# Altium schematic sheet CLOCK.SchDoc
size A3; Organization: ICNS, MARCS Institute; Address1: Werrington South Campus, Great Western Highway; Address2: Werrington, NSW, 2747; SheetNumber: 7; SheetTotal: 16
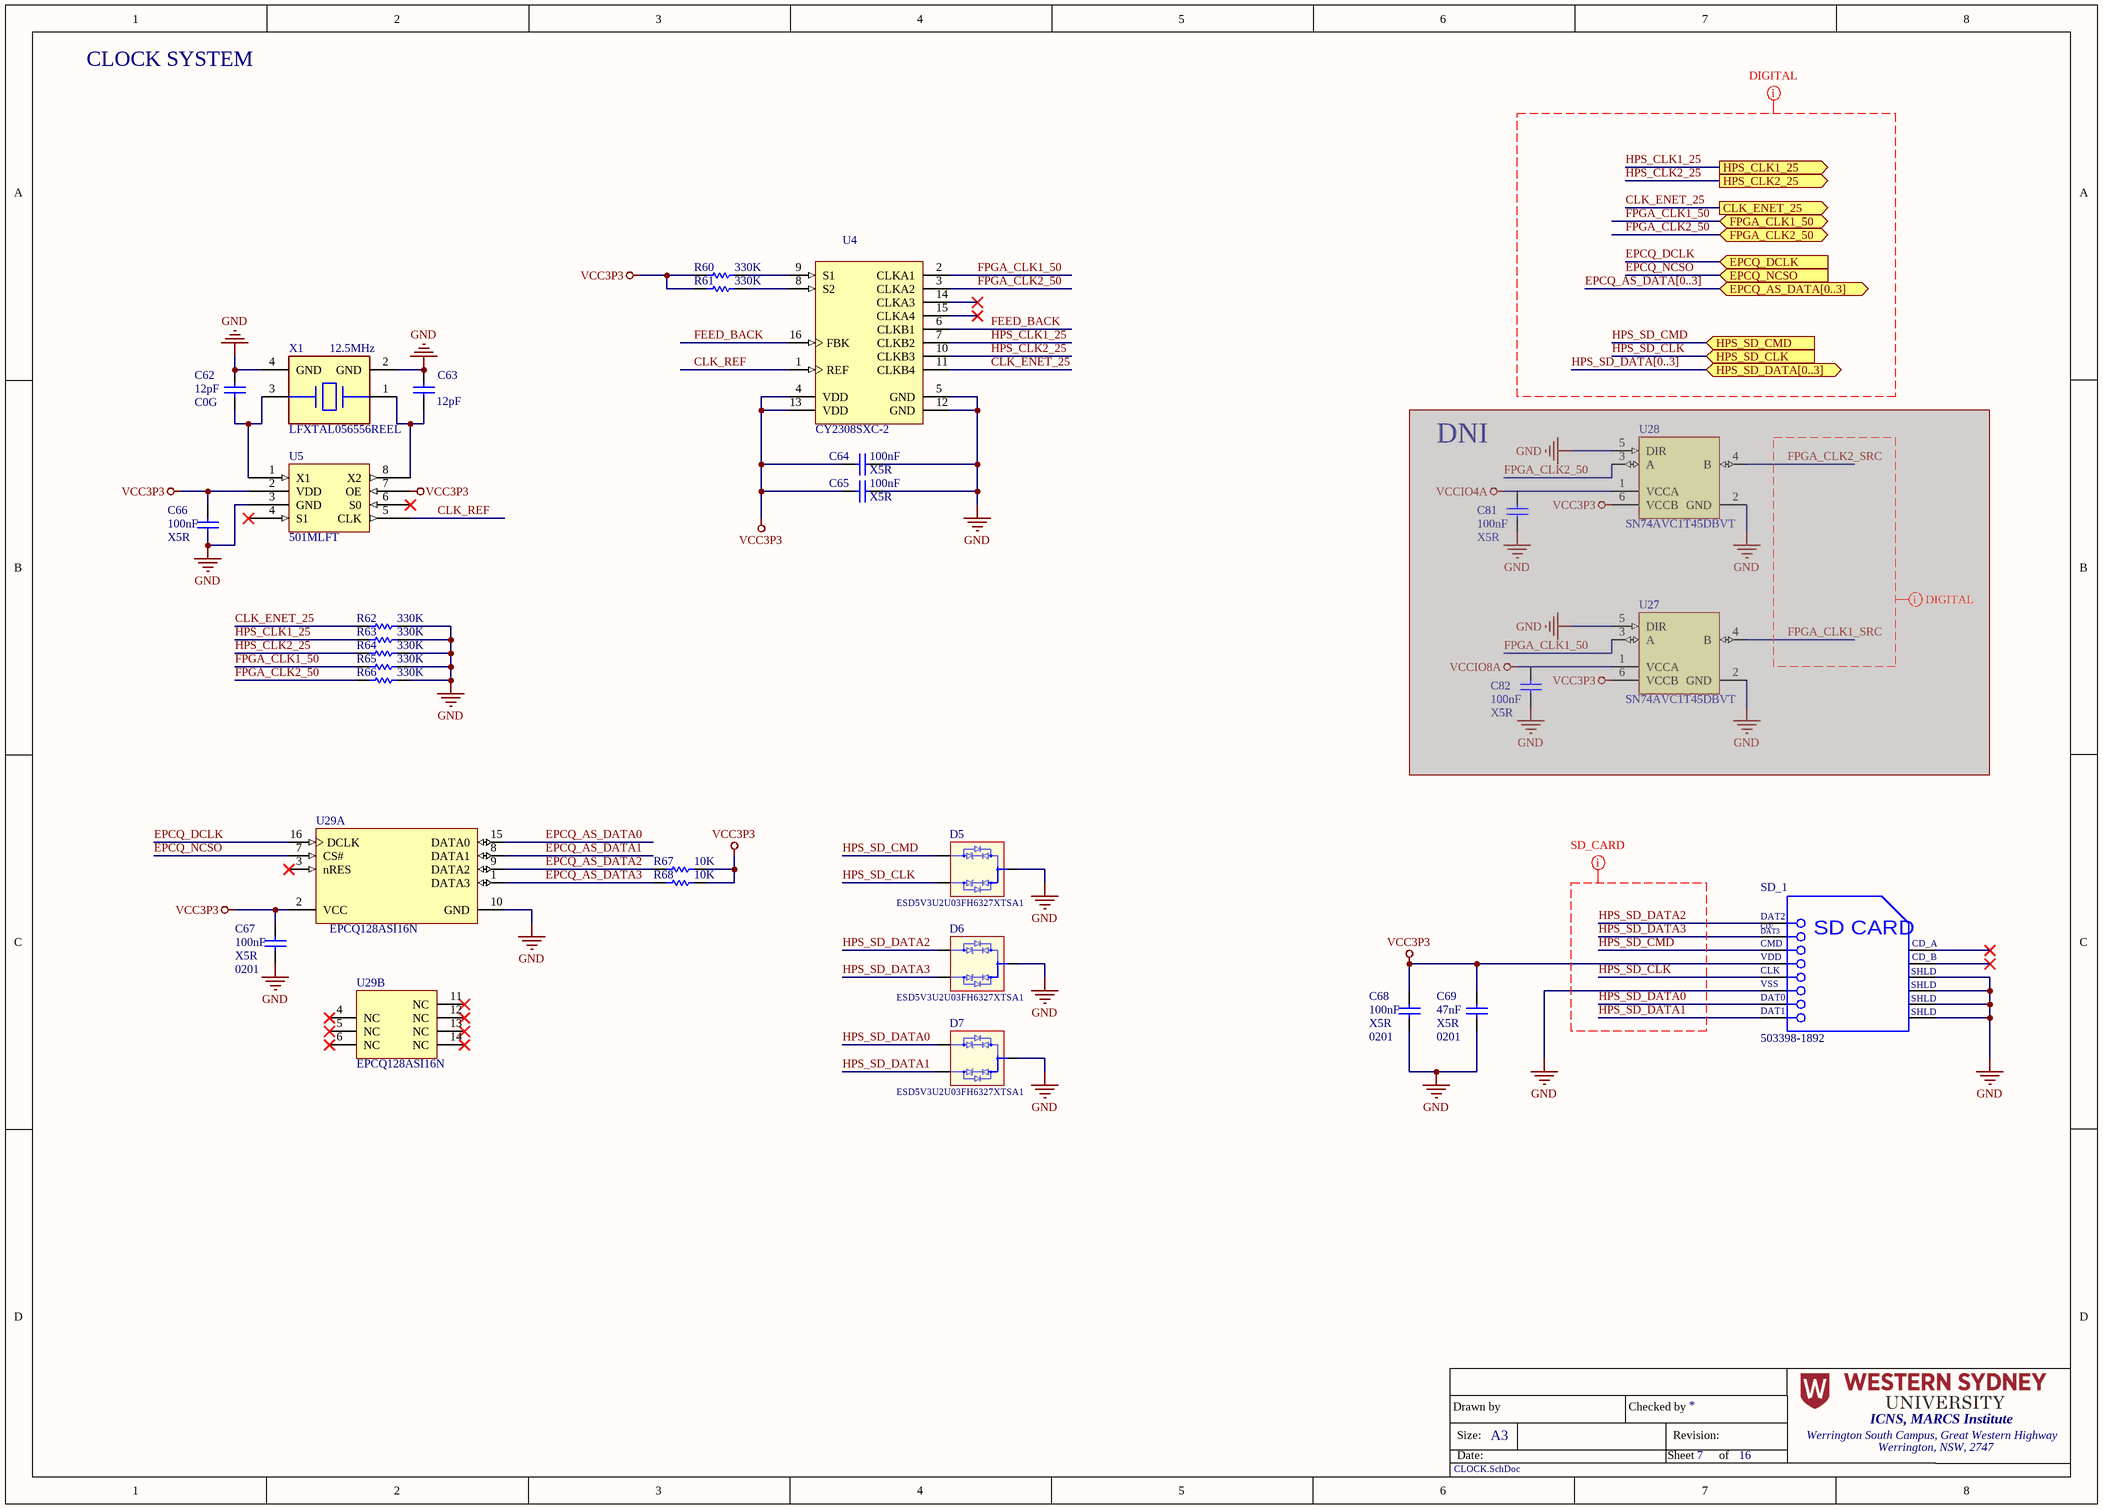
[diagram p0: CLOCK.SchDoc]

## Parts
C62  value 12pF  Dielectric: C0G  [CAP 0201 (0603)]  (hidden comment: GRM0335C1H120GA01D)
C63  value 12pF  [CAP 0201 (0603)]  (hidden comment: GRM0335C1H120GA01D)
C64  Dielectric: X5R  Capacitance: 100nF  [CAP 0201 (0603)]  (hidden comment: CL03A104KP3NNNC)
C65  Dielectric: X5R  Capacitance: 100nF  [CAP 0201 (0603)]  (hidden comment: CL03A104KP3NNNC)
C66  Capacitance: 100nF  Dielectric: X5R  [CAP 0201 (0603)]  (hidden comment: CL03A104KP3NNNC)
C67  Capacitance: 100nF  Case Code (Imperial): 0201  Dielectric: X5R  [CAP 0201 (0603)]  (hidden comment: CL03A104KP3NNNC)
C68  Capacitance: 100nF  Case Code (Imperial): 0201  Dielectric: X5R  [CAP 0201 (0603)]  (hidden comment: CL03A104KP3NNNC)
C69  value 47nF  Dielectric: X5R  Case Code (Imperial): 0201  [CAP 0201 (0603)]  (hidden comment: GRM033R60J473KE19D)
C81  Capacitance: 100nF  Dielectric: X5R  [CAP 0201 (0603)]  (hidden comment: CL03A104KP3NNNC)  (masked out: inside a compile mask, not in the netlist)
C82  Capacitance: 100nF  Dielectric: X5R  [CAP 0201 (0603)]  (hidden comment: CL03A104KP3NNNC)  (masked out: inside a compile mask, not in the netlist)
D5  ESD5V3U2U03FH6327XTSA1  [TSFP-3-1_INF]
D6  ESD5V3U2U03FH6327XTSA1  [TSFP-3-1_INF]
D7  ESD5V3U2U03FH6327XTSA1  [TSFP-3-1_INF]
R60  value 330K  [RES 0201 (0603)]  (hidden comment: ERJ-1GNF3303C)
R61  value 330K  [RES 0201 (0603)]  (hidden comment: ERJ-1GNF3303C)
R62  value 330K  [RES 0201 (0603)]  (hidden comment: ERJ-1GNF3303C)
R63  value 330K  [RES 0201 (0603)]  (hidden comment: ERJ-1GNF3303C)
R64  value 330K  [RES 0201 (0603)]  (hidden comment: ERJ-1GNF3303C)
R65  value 330K  [RES 0201 (0603)]  (hidden comment: ERJ-1GNF3303C)
R66  value 330K  [RES 0201 (0603)]  (hidden comment: ERJ-1GNF3303C)
R67  value 10K  [RES 0201 (0603)]  (hidden comment: AC0201FR-0710KL)
R68  value 10K  [RES 0201 (0603)]  (hidden comment: AC0201FR-0710KL)
SD_1  503398-1892  [MOLX-503398-1892_V]
U4  CY2308SXC-2  [CYP-SX16_N]
U5  501MLFT  [SOIC127P600X135-8N]
U27  SN74AVC1T45DBVT  [DBV0006A_L]  (masked out: inside a compile mask, not in the netlist)
U28  SN74AVC1T45DBVT  [DBV0006A_L]  (masked out: inside a compile mask, not in the netlist)
U29  EPCQ128ASI16N  [SPSN-SOIC-16_L]  (parts A,B of 2)
X1  LFXTAL056556REEL  Frequency: 12.5MHz  [TXC-7B-4_V]

## Ports
CLK_ENET_25 (out), EPCQ_AS_DATA[0..3] (bidir), EPCQ_DCLK (in), EPCQ_NCSO (in), FPGA_CLK1_50 (bidir), FPGA_CLK2_50 (bidir), HPS_CLK1_25 (out), HPS_CLK2_25 (out), HPS_SD_CLK (in), HPS_SD_CMD (in), HPS_SD_DATA[0..3] (bidir)

## Nets
GND: C62.2 C63.1 C64.2 C65.2 C66.2 C67.2 C68.2 C69.2 D5.3(A) D6.3(A) D7.3(A) R62.2 R63.2 R64.2 R65.2 R66.2 SD_1.6(VSS) SD_1.11(SHLD) SD_1.12(SHLD) SD_1.13(SHLD) SD_1.14(SHLD) U4.5(GND) U4.12(GND) U5.3(GND) U29.10(GND) X1.2(GND) X1.4(GND)
VCC3P3: C64.1 C65.1 C66.1 C67.1 C68.1 C69.1 R60.1 R61.1 R67.2 R68.2 SD_1.4(VDD) U4.4(VDD) U4.13(VDD) U5.2(VDD) U5.7(OE) U29.2(VCC)
CLK_ENET_25: R62.1 U4.11(CLKB4) ; port CLK_ENET_25
CLK_REF: U4.1(REF) U5.5(CLK)
EPCQ_AS_DATA0: U29.15(DATA0)
EPCQ_AS_DATA1: U29.8(DATA1)
EPCQ_AS_DATA2: R67.1 U29.9(DATA2)
EPCQ_AS_DATA3: R68.1 U29.1(DATA3)
EPCQ_DCLK: U29.16(DCLK) ; port EPCQ_DCLK
EPCQ_NCSO: U29.7(CS#) ; port EPCQ_NCSO
FEED_BACK: U4.6(CLKB1) U4.16(FBK)
FPGA_CLK1_50: R65.1 U4.2(CLKA1) ; port FPGA_CLK1_50
FPGA_CLK2_50: R66.1 U4.3(CLKA2) ; port FPGA_CLK2_50
HPS_CLK1_25: R63.1 U4.7(CLKB2) ; port HPS_CLK1_25
HPS_CLK2_25: R64.1 U4.10(CLKB3) ; port HPS_CLK2_25
HPS_SD_CLK: D5.2(K2) SD_1.5(CLK) ; port HPS_SD_CLK
HPS_SD_CMD: D5.1(K1) SD_1.3(CMD) ; port HPS_SD_CMD
HPS_SD_DATA0: D7.1(K1) SD_1.7(DAT0)
HPS_SD_DATA1: D7.2(K2) SD_1.8(DAT1)
HPS_SD_DATA2: D6.1(K1) SD_1.1(DAT2)
HPS_SD_DATA3: D6.2(K2) SD_1.2(CD/DAT3)
NetC62_1: C62.1 U5.1(X1) X1.3
NetC63_2: C63.2 U5.8(X2) X1.1
NetR60_2: R60.2 U4.9(S1)
NetR61_2: R61.2 U4.8(S2)

Not connected (* = marked no-connect by the designer): SD_1 9(CD_A)* 10(CD_B)*; U4 14(CLKA3)* 15(CLKA4)*; U5 4(S1)* 6(S0)*; U29 3(nRES)* 4(NC)* 5(NC)* 6(NC)* 11(NC)* 12(NC)* 13(NC)* 14(NC)*

## Buses and harness runs
bus EPCQ_AS_DATA[0..3] = port EPCQ_AS_DATA[0..3]
bus HPS_SD_DATA[0..3] = port HPS_SD_DATA[0..3]

## Layout directives
net class DIGITAL: CLK_ENET_25, EPCQ_AS_DATA[0..3], EPCQ_DCLK, EPCQ_NCSO, FPGA_CLK1_50, FPGA_CLK1_SRC, FPGA_CLK2_50, FPGA_CLK2_SRC, HPS_CLK1_25, HPS_CLK2_25, HPS_SD_CLK, HPS_SD_CMD, HPS_SD_DATA[0..3]
net class SD_CARD: HPS_SD_CLK, HPS_SD_CMD, HPS_SD_DATA0, HPS_SD_DATA1, HPS_SD_DATA2, HPS_SD_DATA3

## Notes on the sheet
- CLOCK SYSTEM
- DNI
- Drawn by
- Size:
- Date:
- A3
- Checked by
- Sheet
- Revision:
- of
- (in symbol CMP-002-00074-2) CD/; DAT3; SD CARD

## Library data of the parts
C62 = CMP-003-000026-2: Cap Multilayer Ceramic 12 pF 50 V C0G/NP0 0201 10%; Manufacturer: Murata; Voltage Rating: 50V; Tolerance: 2%; Termination: SMD/SMT; Mount: Surface Mount; Depth: 0.3mm; Case Code (Metric): 0603; Height: 0.3mm; Voltage Rating (DC): 50V; Case Code (Imperial): 0201; Package Quantity: 15000; Thickness: 0.013inch; Length: 0.6mm; Min Operating Temperature: -55°C; Width: 0.012inch; Capacitance: 12pF; Case/Package: 0201; Packaging: Tape and Reel; Series: GRM; Max Operating Temperature: 125°C; Stock 1: 30000; RoHS: Yes; ComponentLink1Description: https://datasheet.ciiva.com/29538/partnumbering-e-01-29538559.pdf?src-supplier=Digi-Key; Pricing 1: 1=0.00400, 15000=0.00400 (USD); Source: ICNS_PropheseeLib.SchLib; Manufacturer Part Number: GRM0335C1H120GA01D; Category: Ceramic Capacitors; Design Item ID: GRM0335C1H120GA01D; ComponentLink1URL: https://datasheet.ciiva.com/29538/partnumbering-e-01-29538559.pdf?src-supplier=Digi-Key
C63 = CMP-003-000026-2: Cap Multilayer Ceramic 12 pF 50 V C0G/NP0 0201 10%; Manufacturer: Murata; Voltage Rating: 50V; Tolerance: 2%; Dielectric: C0G; Termination: SMD/SMT; Mount: Surface Mount; Depth: 0.3mm; Case Code (Metric): 0603; Height: 0.3mm; Voltage Rating (DC): 50V; Case Code (Imperial): 0201; Package Quantity: 15000; Thickness: 0.013inch; Length: 0.6mm; Min Operating Temperature: -55°C; Width: 0.012inch; Capacitance: 12pF; Case/Package: 0201; Packaging: Tape and Reel; Series: GRM; Max Operating Temperature: 125°C; Stock 1: 30000; RoHS: Yes; ComponentLink1Description: https://datasheet.ciiva.com/29538/partnumbering-e-01-29538559.pdf?src-supplier=Digi-Key; Pricing 1: 1=0.00400, 15000=0.00400 (USD); Source: ICNS_PropheseeLib.SchLib; Manufacturer Part Number: GRM0335C1H120GA01D; Category: Ceramic Capacitors; Design Item ID: GRM0335C1H120GA01D; ComponentLink1URL: https://datasheet.ciiva.com/29538/partnumbering-e-01-29538559.pdf?src-supplier=Digi-Key
C64-C68 C81 C82 = CMP-003-000014-1: Cap Ceramic 0.1uF 10V X5R 10% Pad SMD 0201 85C T/R; Manufacturer: Samsung; Voltage Rating: 10V; Value: 0.1uF; Tolerance: 10%; RoHS: Yes; Source: ICNS_PropheseeLib.SchLib; Depth: 0.3mm; Mount: Surface Mount; Stock 1: 12175; Package Quantity: 1; Packaging: Tape and Reel; ComponentLink1Description: https://datasheet.ciiva.com/25803/cl03a104kp3nnnc-25803204.pdf?src-supplier=Digi-Key; Case Code (Metric): 0603; Manufacturer Part Number: CL03A104KP3NNNC; Lead Free: Lead Free; Width: 0.012inch; Length: 0.6mm; Radiation Hardening: No; Height: 0.3mm; Series: CL; Thickness: 0.013inch; ComponentLink2Description: https://datasheet.ciiva.com/26838/getdatasheetpartid-357484-26838083.pdf?src-supplier=Verical; Max Operating Temperature: 85°C; ComponentLink2URL: https://datasheet.ciiva.com/26838/getdatasheetpartid-357484-26838083.pdf?src-supplier=Verical; Design Item ID: CL03A104KP3NNNC; Voltage Rating (DC): 10V; Case/Package: 0201; Contact Plating: Tin; Category: Ceramic Capacitors; Min Operating Temperature: -55°C; Construction: Flat; Pricing 1: 1=0.10000, 10=0.02900, 50=0.01600, 100=0.01300, 500=0.00932, 1000=0.00732, 2500=0.00666, 5000=0.00612 (USD); ComponentLink1URL: https://datasheet.ciiva.com/25803/cl03a104kp3nnnc-25803204.pdf?src-supplier=Digi-Key
  C64-C66 C81 C82: Case Code (Imperial): 0201
C69 = CMP-003-000019-1: Cap Multilayer Ceramic 47nF 6.3V X5R SMT 0201±10% Tolerance; Manufacturer: Murata; Tolerance: 10%; Depth: 0.3mm; Capacitance: 47nF; Case/Package: 0201; REACH SVHC: No SVHC; Termination: SMD/SMT; Mount: Surface Mount; Radiation Hardening: No; Height: 0.3mm; Min Operating Temperature: -55°C; Max Operating Temperature: 85°C; Thickness: 0.013inch; Length: 0.6mm; Voltage Rating (DC): 6.3V; Material: Ceramic; Lead Free: Lead Free; Packaging: Tape and Reel; Case Code (Metric): 0603; Width: 0.012inch; Voltage Rating: 6.3V; Package Quantity: 15000; ComponentLink3URL: https://datasheet.ciiva.com/29199/455678-da-01-en-vs-kondensator-0201-29199271.pdf?src-supplier=Conrad; Stock 1: 134562; ComponentLink1Description: https://datasheet.ciiva.com/6270/product-6270930.pdf?src-supplier=Digi-Key; RoHS Compliant: Yes; ComponentLink2Description: https://datasheet.ciiva.com/18184/getdatasheetpartid-223883-18184048.pdf?src-supplier=Verical; ComponentLink3Description: https://datasheet.ciiva.com/29199/455678-da-01-en-vs-kondensator-0201-29199271.pdf?src-supplier=Conrad; Category: Ceramic Capacitors; ComponentLink2URL: https://datasheet.ciiva.com/18184/getdatasheetpartid-223883-18184048.pdf?src-supplier=Verical; Series: GRM; ComponentLink1URL: https://datasheet.ciiva.com/6270/product-6270930.pdf?src-supplier=Digi-Key; RoHS: Yes; Source: ICNS_PropheseeLib.SchLib; Manufacturer Part Number: GRM033R60J473KE19D; Construction: Flat; Pricing 1: 1=0.10000, 10=0.05900, 50=0.03240, 100=0.02640, 500=0.01886, 1000=0.01482, 2500=0.01348, 5000=0.01240 (USD); Design Item ID: GRM033R60J473KE19D
D5-D7 = CMP-004-000005-1: ESD5V3U2U Series 2 Line 5.3 V 0.4 pF 15 Vcl Uni-Directional TVS Diode -TSFP-3-1; Manufacturer: Infineon; Min Breakdown Voltage: 6V; Number of Unidirectional Channels: 2; Peak Pulse Current: 3A; Leakage Current: 50nA; Working Voltage: 5.3V; Diode Type: ZENER; Direction: Unidirectional; Clamping Voltage: 15V; Element Configuration: Dual; Power Line Protection: No; Capacitance: 0.6pF; ComponentLink1URL: https://datasheet.ciiva.com/11195/infineon-esd5v3u2useries-ds-v01-03-en-11195325.pdf?src-supplier=Avnet; ComponentLink1Description: https://datasheet.ciiva.com/11195/infineon-esd5v3u2useries-ds-v01-03-en-11195325.pdf?src-supplier=Avnet; Manufacturer Part Number: ESD5V3U2U03FH6327XTSA1; Series: -; Packaging: Tape and Reel; Case/Package: SOT-723; Lead Free: Lead Free; Depth: 0.8mm; RoHS: Yes; Max Operating Temperature: 125°C; Stock 1: 2789; Mount: Surface Mount; Resistor Type: Zener; Category: Diodes; Source: ICNS_PropheseeLib.SchLib; Pricing 1: 1=0.41000, 10=0.33100, 100=0.22520, 500=0.16892, 1000=0.12668 (USD); Contact Plating: Tin,Matte; Halogen Free: Halogen Free; Design Item ID: ESD5V3U2U03FH6327XTSA1; Length: 1.2mm; Number of Pins: 3; Radiation Hardening: No; Reverse Standoff Voltage: 5.3V; Min Operating Temperature: -40°C
R60-R66 = CMP-006-000055-1: Res Thick Film 0201 330K Ohm 1% 0.05W(1/20W) ±200ppm/C Pad SMD Automotive T/R; Manufacturer: Panasonic; Voltage Rating (DC): 25V; Resistance: 330kR; Max Power Dissipation: 50mW; Temperature Coefficient: 200ppm/°C; Case Code (Imperial): 0201; Length: 0.024inch; Source: ICNS_PropheseeLib.SchLib; Radiation Hardening: No; REACH SVHC: No SVHC; ComponentLink4URL: https://datasheet.ciiva.com/24069/aoa0000ce2-24069610.pdf?src-supplier=Mouser; Manufacturer Part Number: ERJ-1GNF3303C; Number of Terminations: 2; RoHS Compliant: Yes; Package Quantity: 15000; Packaging: Tape and Reel; Tolerance: 1%; Case/Package: 0201; RoHS: Yes; Resistor Type: Thick Film; Category: Chip SMD Resistors; Design Item ID: ERJ-1GNF3303C; Height: 0.01inch; Voltage Rating: 25V; Number of Pins: 2; ComponentLink3URL: https://datasheet.ciiva.com/46375/1678782-46375419.pdf?src-supplier=Element14; ComponentLink3Description: https://datasheet.ciiva.com/46375/1678782-46375419.pdf?src-supplier=Element14; Power Rating: 50mW; ComponentLink1Description: https://datasheet.ciiva.com/7836/1678782-7836473.pdf?src-supplier=Element14; Stock 1: 15000; ComponentLink4Description: https://datasheet.ciiva.com/24069/aoa0000ce2-24069610.pdf?src-supplier=Mouser; Mount: Surface Mount; Series: ERJ; ComponentLink2URL: https://datasheet.ciiva.com/43467/1678782-43467114.pdf?src-supplier=Farnell; Width: 0.3mm; ComponentLink2Description: https://datasheet.ciiva.com/43467/1678782-43467114.pdf?src-supplier=Farnell; Pricing 1: 15000=0.00900 (USD); Resistance Tolerance: 1%; ComponentLink1URL: https://datasheet.ciiva.com/7836/1678782-7836473.pdf?src-supplier=Element14; Case Code (Metric): 0603; Min Operating Temperature: -55°C; Termination: SMD/SMT; Max Operating Temperature: 125°C
R67 R68 = CMP-006-000021-1: Res Thick Film 0201 10K Ohm 1% 0.05W(1/20W) ±200ppm/C Pad SMD Automotive T/R; Manufacturer: Yageo; Max Power Dissipation: 50mW; Resistance: 10kR; Temperature Coefficient: 200ppm/°C; Length: 0.024inch; Packaging: Tape and Reel; ComponentLink1URL: http://www.yageo.com/NewPortal/yageodocoutput?fileName=/pdf/R-Chip/PYu-AC_51_RoHS_L_6.pdf&src-supplier=Digi-Key; Number of Terminations: 2; Case/Package: 0201; Source: ICNS_PropheseeLib.SchLib; Case Code (Metric): 0603; Manufacturer Part Number: AC0201FR-0710KL; ComponentLink1Description: http://www.yageo.com/NewPortal/yageodocoutput?fileName=/pdf/R-Chip/PYu-AC_51_RoHS_L_6.pdf&src-supplier=Digi-Key; Min Operating Temperature: -55°C; Category: Chip SMD Resistors; Width: 0.012inch; RoHS: Yes; Max Operating Temperature: 155°C; Features: Moisture Resistant,Automotive AEC-Q200; Pricing 1: 1=0.10000, 10=0.06600, 100=0.02670, 1000=0.01201, 2500=0.01042, 5000=0.00861 (USD); Case Code (Imperial): 0201; Resistor Type: Thick Film; Stock 1: 698280; Design Item ID: AC0201FR-0710KL; Height: 0.01inch; Tolerance: 1%
SD_1 = CMP-002-00074-2: 1.10mm Pitch microSD Memory Card Connector, Normal Mount Surface Mount, Push-Push Type, 1.28mm Height; Current Rating: 500mA; Number of Circuits: 8; Voltage Rating (AC): 10V; Gender: Male; Pitch: 1.1mm; Packaging: Tape and Reel; Package Quantity: 2400; Mount: Surface Mount; Connector Type: Connector; Orientation: Right Angle; Number of Rows: 1; Number of Contacts: 8; Contact Material: Bronze,Stainless Steel; Length: 13.6mm; Halogen Free: Low Halogen; RoHS Compliant: Yes; Depth: 14.05mm; Max Operating Temperature: 85°C; REACH SVHC: Unknown; Radiation Hardening: No; Termination: Solder; Housing Material: Thermoplastic; Contact Plating: Gold; Width: 14.05mm; Min Operating Temperature: -25°C
U4 = CMP-008-000014-1: CY2308 Series Single PLL 3.3 V 133 MHz Zero Delay Clock Buffer SMT - SOIC-16; Manufacturer: Cypress; Number of Circuits: 1; Max Frequency: 133.3MHz; Input: LVTTL; PLL: Yes; Supply Voltage-Nom: 3.3V; Max Supply Voltage: 3.6V; Supply Current: 45mA; Min Supply Voltage: 3V; Number of Outputs: 8; RoHS: Yes; ComponentLink1Description: https://datasheet.ciiva.com/3998/docid49864-3998176.pdf?src-supplier=Arrow+Electronics; ComponentLink1URL: https://datasheet.ciiva.com/3998/docid49864-3998176.pdf?src-supplier=Arrow+Electronics; ComponentLink2Description: https://datasheet.ciiva.com/7648/59839-7648840.pdf?src-supplier=Element14; ComponentLink2URL: https://datasheet.ciiva.com/7648/59839-7648840.pdf?src-supplier=Element14; Manufacturer Part Number: CY2308SXC-2; Category: Clock Generators, PLLs, Frequency Synthesizers; Case/Package: SOIC; Min Operating Temperature: 0°C; Max Operating Temperature: 70°C; Package Quantity: 48; Packaging: Rail/Tube; Series: CY2308SXC; Design Item ID: CY2308SXC-2; Source: ICNS_PropheseeLib.SchLib; Number of Elements: 1; Contact Plating: Tin,Gold,Matte; Lead Free: Lead Free; ComponentLink5URL: https://datasheet.ciiva.com/1491/1509765-1491096.pdf?src-supplier=Element14; ComponentLink5Description: https://datasheet.ciiva.com/1491/1509765-1491096.pdf?src-supplier=Element14; Stock 1: 110; Number of Pins: 16; Frequency: 133.3MHz; RoHS Compliant: Yes; ComponentLink4URL: https://datasheet.ciiva.com/6676/cy2308-6676491.pdf?src-supplier=Digi-Key; ComponentLink3URL: https://datasheet.ciiva.com/30514/1921215-30514044.pdf?src-supplier=Jameco; Pricing 1: 1=10.85700, 10=9.41800, 25=9.24200, 100=7.68600, 250=7.12500, 500=7.05400, 1000=6.59300 (USD); Nominal Supply Current: 45mA; Operating Supply Voltage: 3.3V; ComponentLink4Description: https://datasheet.ciiva.com/6676/cy2308-6676491.pdf?src-supplier=Digi-Key; ComponentLink3Description: https://datasheet.ciiva.com/30514/1921215-30514044.pdf?src-supplier=Jameco; REACH SVHC: Unknown; Radiation Hardening: No
U5 = CMP-023-00000-3: PLL Clock Multiplier Single 8-Pin SOIC N T/R
U27 U28 = CMP-008-000009-1: Voltage Level Translator 1-CH Bidirectional 6-Pin SOT-23 T/R; Manufacturer: Texas Instruments; Output Type: 3-STATE; Number of Inputs: 1; Turn-On Delay Time: 5.6ns; Data Rate: 500Mbps; Low Level Output Current: 12mA; High Level Output Current: -12mA; Polarity: Non-Inverting; Max Supply Voltage: 3.6V; Propagation Delay: 2.8ns; Supply Current: 20uA; Min Supply Voltage: 1.2V; Number of Outputs: 2; Logic Function: Translator,Transceiver,Inverting; Weight: 0.000229oz; Series: 74AVC; Number of Channels: 1; Direction: Bidirectional; ComponentLink1Description: https://datasheet.ciiva.com/15086/getdatasheetpartid-49148-15086029.pdf?src-supplier=Verical; Min Operating Temperature: -40°C; Number of Bits: 1; ComponentLink2Description: https://datasheet.ciiva.com/7743/1534571-7743943.pdf?src-supplier=Element14; ComponentLink6URL: https://datasheet.ciiva.com/1508/1862374-1508650.pdf?src-supplier=Element14; Number of Pins: 6; Manufacturer Part Number: SN74AVC1T45DBVT; ComponentLink4Description: https://datasheet.ciiva.com/6614/sn74avc1t45-6614761.pdf?src-supplier=Digi-Key; Package Quantity: 250; RoHS Compliant: Yes; Height: 1.15mm; Category: Logic ICs; Width: 1.6mm; Stock 1: 5705; ComponentLink3URL: https://datasheet.ciiva.com/6614/sn74avc1t45-6614758.pdf?src-supplier=Digi-Key; RoHS: Yes; ComponentLink4URL: https://datasheet.ciiva.com/6614/sn74avc1t45-6614761.pdf?src-supplier=Digi-Key; ComponentLink6Description: https://datasheet.ciiva.com/1508/1862374-1508650.pdf?src-supplier=Element14; Technology: CMOS; ComponentLink7Description: https://datasheet.ciiva.com/1508/1862374-1508651.pdf?src-supplier=Element14; ComponentLink7URL: https://datasheet.ciiva.com/1508/1862374-1508651.pdf?src-supplier=Element14; Packaging: Tape and Reel; ComponentLink5URL: https://datasheet.ciiva.com/14287/sn74avc1t45-14287992.pdf?src-supplier=Avnet; ComponentLink1URL: https://datasheet.ciiva.com/15086/getdatasheetpartid-49148-15086029.pdf?src-supplier=Verical; ComponentLink3Description: https://datasheet.ciiva.com/6614/sn74avc1t45-6614758.pdf?src-supplier=Digi-Key; Number of Elements: 1; Case/Package: SOT-23; Design Item ID: SN74AVC1T45DBVT; ComponentLink5Description: https://datasheet.ciiva.com/14287/sn74avc1t45-14287992.pdf?src-supplier=Avnet; Radiation Hardening: No; Max Operating Temperature: 85°C; Lead Free: Lead Free; Nominal Supply Current: 20uA; REACH SVHC: No SVHC; ComponentLink2URL: https://datasheet.ciiva.com/7743/1534571-7743943.pdf?src-supplier=Element14; Mount: Surface Mount; Contact Plating: Gold; Source: ICNS_PropheseeLib.SchLib; Pricing 1: 1=1.33000, 10=1.18800, 25=1.12800, 100=0.92640 (USD); Quiescent Current: 20uA; Length: 2.9mm; Output Current: 12mA
U29 = CMP-015-000003-2: NOR Flash Serial 3.3V 128M-bit 16-Pin SOIC W; Manufacturer: Intel; Memory Size: 128Mb; Min Operating Temperature: -40°C; Max Operating Temperature: 85°C; ComponentLink1URL: https://www.intel.com/content/dam/www/programmable/us/en/pdfs/literature/hb/cfg/cfg_cf52014.pdf?src-supplier=Digi-Key; Stock 1: 3218; Packaging: Rail/Tube; ComponentLink1Description: https://www.intel.com/content/dam/www/programmable/us/en/pdfs/literature/hb/cfg/cfg_cf52014.pdf?src-supplier=Digi-Key; Pricing 1: 1=39.60000 (USD); Source: ICNS_PropheseeLib.SchLib; Design Item ID: EPCQ128ASI16N; RoHS: Yes; Manufacturer Part Number: EPCQ128ASI16N; Case/Package: SOIC
X1 = CMP-002-000003-1: Crystal 12.5MHz ±50ppm (Tol) ±50ppm (Stability) 18pF FUND 70Ohm 4-Pin CSMD T/R; Manufacturer: IQD; ESR (Equivalent Series Resistance): 70R; Min Operating Temperature: -40°C; Packaging: Cut Tape; ComponentLink1URL: https://www.iqdfrequencyproducts.com/products/pn/LFXTAL056556Reel.pdf?src-supplier=Digi-Key; ComponentLink1Description: https://www.iqdfrequencyproducts.com/products/pn/LFXTAL056556Reel.pdf?src-supplier=Digi-Key; Max Operating Temperature: 85°C; Mount: Surface Mount; Manufacturer Part Number: LFXTAL056556REEL; RoHS: Yes; Stock 1: 1000; Pricing 1: 1=0.88000, 10=0.77800, 50=0.72740, 100=0.64290, 500=0.60904 (USD); Case/Package: SMD/SMT; Frequency Stability: 50ppm; Frequency Tolerance: 50ppm; Load Capacitance: 18pF; RoHS Compliant: Yes; Design Item ID: LFXTAL056556REEL; Source: crystal.SchLib